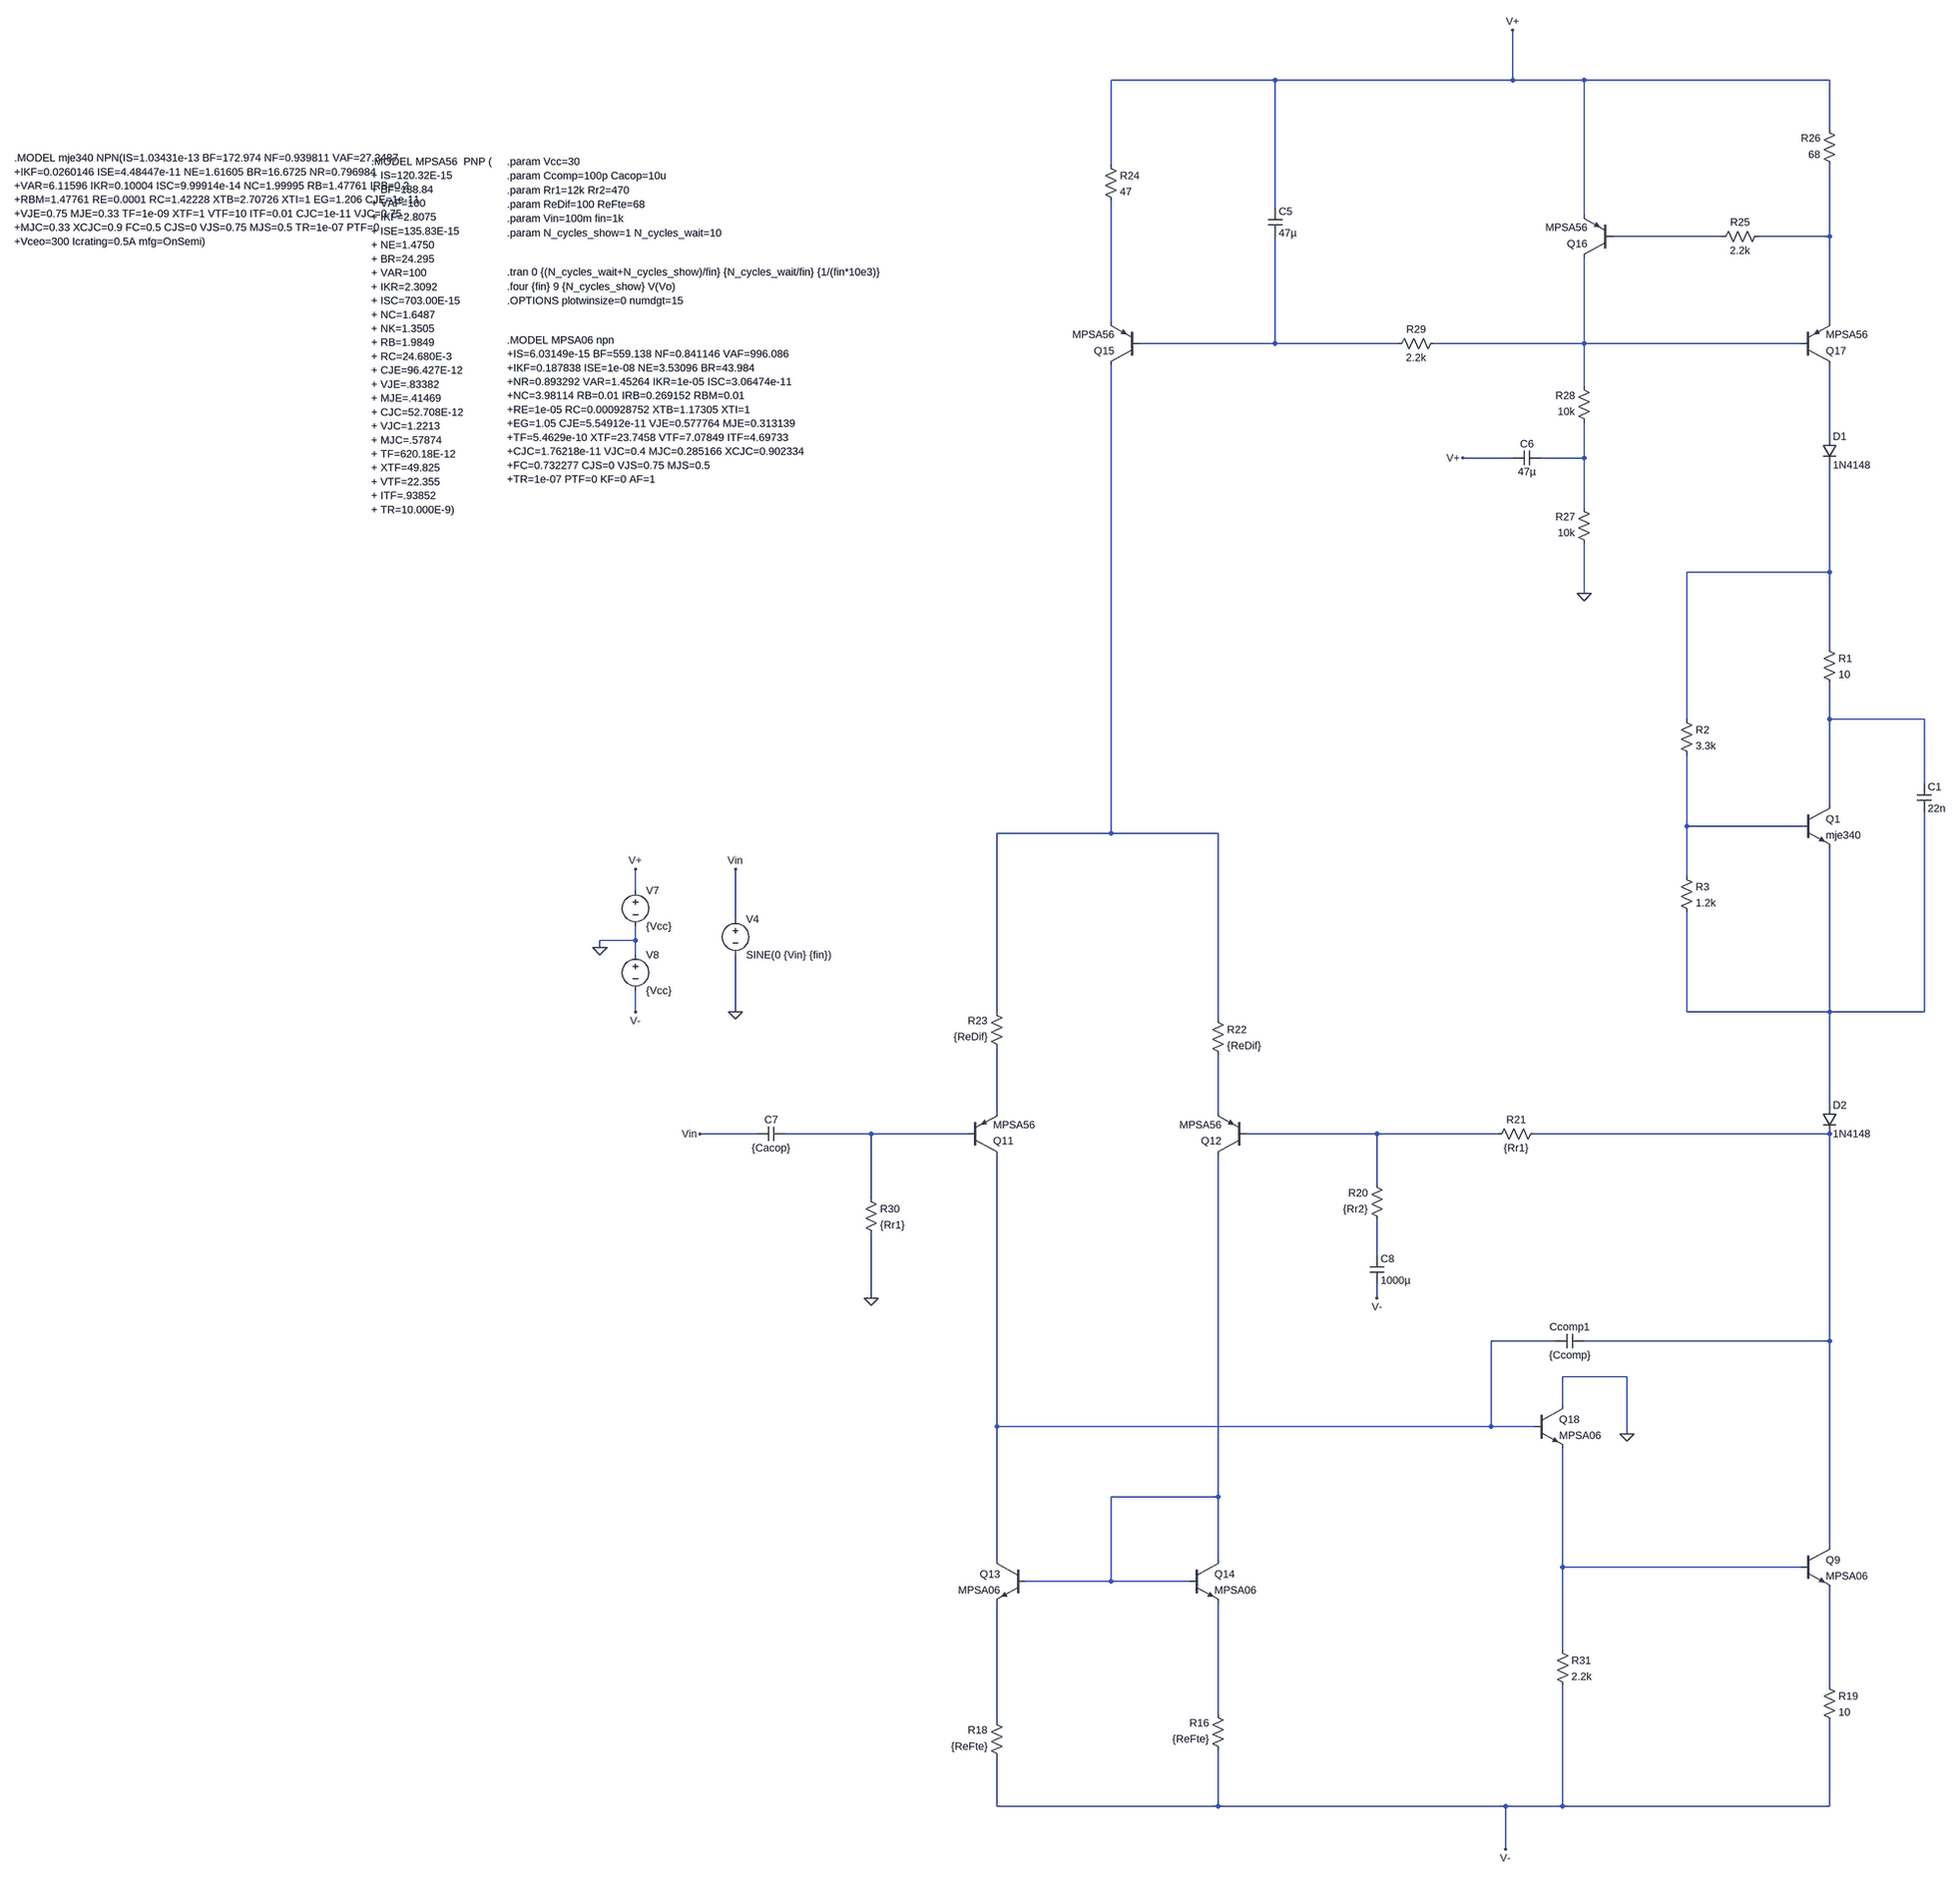
[diagram p0: schematic a.asc]
a.asc, the LTspice schematic file:
Version 4
SHEET 1 4644 2696
WIRE 1792 -1888 1424 -1888
WIRE 2384 -1888 2384 -2032
WIRE 2384 -1888 1792 -1888
WIRE 2544 -1888 2384 -1888
WIRE 3104 -1888 2544 -1888
WIRE 3104 -1776 3104 -1888
WIRE 1424 -1696 1424 -1888
WIRE 1792 -1600 1792 -1888
WIRE 2544 -1584 2544 -1888
WIRE 2864 -1536 2608 -1536
WIRE 3104 -1536 3104 -1696
WIRE 3104 -1536 2944 -1536
WIRE 1424 -1344 1424 -1616
WIRE 3104 -1344 3104 -1536
WIRE 1792 -1296 1792 -1536
WIRE 1792 -1296 1488 -1296
WIRE 2128 -1296 1792 -1296
WIRE 2544 -1296 2544 -1488
WIRE 2544 -1296 2208 -1296
WIRE 3040 -1296 2544 -1296
WIRE 2544 -1200 2544 -1296
WIRE 3104 -1088 3104 -1248
WIRE 2384 -1040 2272 -1040
WIRE 2544 -1040 2544 -1120
WIRE 2544 -1040 2448 -1040
WIRE 2544 -928 2544 -1040
WIRE 3104 -784 3104 -1024
WIRE 3104 -784 2784 -784
WIRE 2544 -736 2544 -848
WIRE 3104 -608 3104 -784
WIRE 2784 -448 2784 -784
WIRE 3104 -448 3104 -528
WIRE 3328 -448 3104 -448
WIRE 3328 -304 3328 -448
WIRE 3104 -256 3104 -448
WIRE 2784 -208 2784 -368
WIRE 3040 -208 2784 -208
WIRE 1424 -192 1424 -1248
WIRE 1424 -192 1168 -192
WIRE 1664 -192 1424 -192
WIRE 2784 -96 2784 -208
WIRE 352 -64 352 -112
WIRE 576 0 576 -112
WIRE 352 48 352 16
WIRE 352 48 272 48
WIRE 272 64 272 48
WIRE 352 80 352 48
WIRE 352 208 352 160
WIRE 576 208 576 80
WIRE 1168 208 1168 -192
WIRE 2784 208 2784 -16
WIRE 3104 208 3104 -160
WIRE 3104 208 2784 208
WIRE 3328 208 3328 -240
WIRE 3328 208 3104 208
WIRE 1664 224 1664 -192
WIRE 3104 704 3104 208
WIRE 1168 720 1168 288
WIRE 1664 720 1664 304
WIRE 624 768 496 768
WIRE 880 768 688 768
WIRE 1104 768 880 768
WIRE 2080 768 1728 768
WIRE 2352 768 2080 768
WIRE 3104 768 2432 768
WIRE 2080 880 2080 768
WIRE 880 912 880 768
WIRE 2080 1040 2080 960
WIRE 880 1136 880 992
WIRE 2080 1136 2080 1104
WIRE 2480 1232 2336 1232
WIRE 3104 1232 3104 768
WIRE 3104 1232 2544 1232
WIRE 2640 1312 2496 1312
WIRE 2496 1376 2496 1312
WIRE 1168 1424 1168 816
WIRE 2336 1424 2336 1232
WIRE 2336 1424 1168 1424
WIRE 2432 1424 2336 1424
WIRE 2640 1440 2640 1312
WIRE 1664 1696 1664 816
WIRE 1664 1696 1424 1696
WIRE 3104 1824 3104 1232
WIRE 1168 1856 1168 1424
WIRE 1664 1856 1664 1696
WIRE 2496 1872 2496 1472
WIRE 3040 1872 2496 1872
WIRE 1424 1904 1424 1696
WIRE 1424 1904 1232 1904
WIRE 1600 1904 1424 1904
WIRE 2496 2064 2496 1872
WIRE 3104 2144 3104 1920
WIRE 1664 2208 1664 1952
WIRE 1168 2224 1168 1952
WIRE 1168 2528 1168 2304
WIRE 1664 2528 1664 2288
WIRE 1664 2528 1168 2528
WIRE 2368 2528 1664 2528
WIRE 2496 2528 2496 2144
WIRE 2496 2528 2368 2528
WIRE 3104 2528 3104 2224
WIRE 3104 2528 2496 2528
WIRE 2368 2624 2368 2528
FLAG 576 208 0
FLAG 576 -112 Vin
FLAG 2544 -736 0
FLAG 2272 -1040 V+
FLAG 2080 1136 V-
FLAG 880 1136 0
FLAG 496 768 Vin
FLAG 2640 1440 0
FLAG 272 64 0
FLAG 352 -112 V+
FLAG 352 208 V-
FLAG 2384 -2032 V+
FLAG 2368 2624 V-
DATAFLAG 2080 768 ""
DATAFLAG 1424 -192 ""
DATAFLAG 880 768 ""
DATAFLAG 1424 -896 "-Ic(Q15)"
DATAFLAG 1168 32 "-I(R23)"
DATAFLAG 1664 32 "I(R22)"
DATAFLAG 1168 2096 ""
DATAFLAG 1664 2096 ""
DATAFLAG 1168 1424 ""
DATAFLAG 1664 1696 ""
DATAFLAG 2496 1872 ""
DATAFLAG 2496 1632 "Ic(Q18)"
DATAFLAG 3104 2048 ""
DATAFLAG 3104 2352 "I(R19)"
DATAFLAG 1424 -1488 ""
DATAFLAG 3104 -1552 ""
DATAFLAG 2544 -1296 ""
DATAFLAG 1776 -1296 ""
DATAFLAG 1168 960 "-Ic(Q11)"
DATAFLAG 1664 960 "-Ic(Q12)"
DATAFLAG 3104 1472 "Ic(Q9)"
DATAFLAG 3104 448 ""
DATAFLAG 3104 -784 ""
DATAFLAG 3104 -448 ""
DATAFLAG 1312 -1632 "V(v+)-V(n003)"
DATAFLAG 3216 -1728 "V(v+)-v(n002)"
DATAFLAG 976 256 "V(n011)-v(n013)"
DATAFLAG 1824 240 "V(n011)-v(n014)"
DATAFLAG 976 2272 "V(n024)-v(v-)"
DATAFLAG 1776 2256 "V(n023)-v(v-)"
DATAFLAG 2352 2112 "V(n021)-v(v-)"
DATAFLAG 3264 2192 "V(n022)-v(v-)"
DATAFLAG 3104 1232 ""
SYMBOL res 1680 2304 R180
WINDOW 0 36 76 Left 2
WINDOW 3 36 40 Left 2
SYMATTR InstName R16
SYMATTR Value {ReFte}
SYMBOL res 1184 2320 R180
WINDOW 0 36 76 Left 2
WINDOW 3 36 40 Left 2
SYMATTR InstName R18
SYMATTR Value {ReFte}
SYMBOL npn 3040 1824 R0
SYMATTR InstName Q9
SYMATTR Value MPSA06
SYMBOL voltage 576 -16 R0
WINDOW 123 0 0 Left 2
WINDOW 39 0 0 Left 2
SYMATTR InstName V4
SYMATTR Value SINE(0 {Vin} {fin})
SYMBOL res 3088 2128 R0
SYMATTR InstName R19
SYMATTR Value 10
SYMBOL res 2096 976 R180
WINDOW 0 36 76 Left 2
WINDOW 3 36 40 Left 2
SYMATTR InstName R20
SYMATTR Value {Rr2}
SYMBOL pnp 1104 816 M180
SYMATTR InstName Q11
SYMATTR Value MPSA56
SYMBOL pnp 1728 816 R180
SYMATTR InstName Q12
SYMATTR Value MPSA56
SYMBOL npn 1232 1856 M0
SYMATTR InstName Q13
SYMATTR Value MPSA06
SYMBOL npn 1600 1856 R0
SYMATTR InstName Q14
SYMATTR Value MPSA06
SYMBOL res 2448 752 R90
WINDOW 0 0 56 VBottom 2
WINDOW 3 32 56 VTop 2
SYMATTR InstName R21
SYMATTR Value {Rr1}
SYMBOL res 1648 208 R0
SYMATTR InstName R22
SYMATTR Value {ReDif}
SYMBOL res 1184 304 R180
WINDOW 0 36 76 Left 2
WINDOW 3 36 40 Left 2
SYMATTR InstName R23
SYMATTR Value {ReDif}
SYMBOL pnp 1488 -1248 R180
SYMATTR InstName Q15
SYMATTR Value MPSA56
SYMBOL pnp 2608 -1488 R180
SYMATTR InstName Q16
SYMATTR Value MPSA56
SYMBOL pnp 3040 -1248 M180
SYMATTR InstName Q17
SYMATTR Value MPSA56
SYMBOL cap 1776 -1600 R0
SYMATTR InstName C5
SYMATTR Value 47µ
SYMBOL cap 2384 -1024 R270
WINDOW 0 32 32 VTop 2
WINDOW 3 0 32 VBottom 2
SYMATTR InstName C6
SYMATTR Value 47µ
SYMBOL res 1408 -1712 R0
SYMATTR InstName R24
SYMATTR Value 47
SYMBOL res 2960 -1552 R90
WINDOW 0 0 56 VBottom 2
WINDOW 3 32 56 VTop 2
SYMATTR InstName R25
SYMATTR Value 2.2k
SYMBOL res 3120 -1680 R180
WINDOW 0 36 76 Left 2
WINDOW 3 36 40 Left 2
SYMATTR InstName R26
SYMATTR Value 68
SYMBOL res 2560 -832 R180
WINDOW 0 36 76 Left 2
WINDOW 3 36 40 Left 2
SYMATTR InstName R27
SYMATTR Value 10k
SYMBOL res 2560 -1104 R180
WINDOW 0 36 76 Left 2
WINDOW 3 36 40 Left 2
SYMATTR InstName R28
SYMATTR Value 10k
SYMBOL res 2112 -1280 R270
WINDOW 0 32 56 VTop 2
WINDOW 3 0 56 VBottom 2
SYMATTR InstName R29
SYMATTR Value 2.2k
SYMBOL res 864 896 R0
SYMATTR InstName R30
SYMATTR Value {Rr1}
SYMBOL cap 688 752 R90
WINDOW 0 0 32 VBottom 2
WINDOW 3 32 32 VTop 2
SYMATTR InstName C7
SYMATTR Value {Cacop}
SYMBOL cap 2064 1040 R0
SYMATTR InstName C8
SYMATTR Value 1000µ
SYMBOL npn 2432 1376 R0
SYMATTR InstName Q18
SYMATTR Value MPSA06
SYMBOL res 2480 2048 R0
SYMATTR InstName R31
SYMATTR Value 2.2k
SYMBOL cap 2544 1216 R90
WINDOW 0 0 32 VBottom 2
WINDOW 3 32 32 VTop 2
SYMATTR InstName Ccomp1
SYMATTR Value {Ccomp}
SYMBOL voltage 352 -80 R0
WINDOW 123 0 0 Left 2
WINDOW 39 0 0 Left 2
SYMATTR InstName V7
SYMATTR Value {Vcc}
SYMBOL voltage 352 64 R0
WINDOW 123 0 0 Left 2
WINDOW 39 0 0 Left 2
SYMATTR InstName V8
SYMATTR Value {Vcc}
SYMBOL npn 3040 -256 R0
SYMATTR InstName Q1
SYMATTR Value mje340
SYMBOL res 3088 -624 R0
SYMATTR InstName R1
SYMATTR Value 10
SYMBOL res 2768 -464 R0
SYMATTR InstName R2
SYMATTR Value 3.3k
SYMBOL res 2768 -112 R0
SYMATTR InstName R3
SYMATTR Value 1.2k
SYMBOL cap 3312 -304 R0
SYMATTR InstName C1
SYMATTR Value 22n
SYMBOL diode 3088 -1088 R0
SYMATTR InstName D1
SYMATTR Value 1N4148
SYMBOL diode 3088 704 R0
SYMATTR InstName D2
SYMATTR Value 1N4148
TEXT 64 -1456 Left 2 !.tran 0 {(N_cycles_wait+N_cycles_show)/fin} {N_cycles_wait/fin} {1/(fin*10e3)}
TEXT 64 -1424 Left 2 !.four {fin} 9 {N_cycles_show} V(Vo)
TEXT 64 -1392 Left 2 !.OPTIONS plotwinsize=0 numdgt=15
TEXT 64 -1544 Left 2 !.param N_cycles_show=1 N_cycles_wait=10
TEXT 64 -1576 Left 2 !.param Vin=100m fin=1k
TEXT 64 -1608 Left 2 !.param ReDif=100 ReFte=68
TEXT 64 -1640 Left 2 !.param Rr1=12k Rr2=470
TEXT 64 -1672 Left 2 !.param Ccomp=100p Cacop=10u
TEXT 64 -1704 Left 2 !.param Vcc=30
TEXT -240 -1704 Left 2 !.MODEL MPSA56  PNP (\n+ IS=120.32E-15\n+ BF=188.84\n+ VAF=100\n+ IKF=2.8075\n+ ISE=135.83E-15\n+ NE=1.4750\n+ BR=24.295\n+ VAR=100\n+ IKR=2.3092\n+ ISC=703.00E-15\n+ NC=1.6487\n+ NK=1.3505\n+ RB=1.9849\n+ RC=24.680E-3\n+ CJE=96.427E-12\n+ VJE=.83382\n+ MJE=.41469\n+ CJC=52.708E-12\n+ VJC=1.2213\n+ MJC=.57874\n+ TF=620.18E-12\n+ XTF=49.825\n+ VTF=22.355\n+ ITF=.93852\n+ TR=10.000E-9)
TEXT 64 -1304 Left 2 !.MODEL MPSA06 npn\n+IS=6.03149e-15 BF=559.138 NF=0.841146 VAF=996.086\n+IKF=0.187838 ISE=1e-08 NE=3.53096 BR=43.984\n+NR=0.893292 VAR=1.45264 IKR=1e-05 ISC=3.06474e-11\n+NC=3.98114 RB=0.01 IRB=0.269152 RBM=0.01\n+RE=1e-05 RC=0.000928752 XTB=1.17305 XTI=1\n+EG=1.05 CJE=5.54912e-11 VJE=0.577764 MJE=0.313139\n+TF=5.4629e-10 XTF=23.7458 VTF=7.07849 ITF=4.69733\n+CJC=1.76218e-11 VJC=0.4 MJC=0.285166 XCJC=0.902334\n+FC=0.732277 CJS=0 VJS=0.75 MJS=0.5\n+TR=1e-07 PTF=0 KF=0 AF=1
TEXT -1040 -1712 Left 2 !.MODEL mje340 NPN(IS=1.03431e-13 BF=172.974 NF=0.939811 VAF=27.3487\n+IKF=0.0260146 ISE=4.48447e-11 NE=1.61605 BR=16.6725 NR=0.796984\n+VAR=6.11596 IKR=0.10004 ISC=9.99914e-14 NC=1.99995 RB=1.47761 IRB=0.2\n+RBM=1.47761 RE=0.0001 RC=1.42228 XTB=2.70726 XTI=1 EG=1.206 CJE=1e-11\n+VJE=0.75 MJE=0.33 TF=1e-09 XTF=1 VTF=10 ITF=0.01 CJC=1e-11 VJC=0.75\n+MJC=0.33 XCJC=0.9 FC=0.5 CJS=0 VJS=0.75 MJS=0.5 TR=1e-07 PTF=0\n+Vceo=300 Icrating=0.5A mfg=OnSemi)

The netlist it stands for:
* a.asc
R16 V- N023 {ReFte}
R18 V- N024 {ReFte}
Q9 N017 N021 N022 0 MPSA06
V4 Vin 0 SINE(0 {Vin} {fin})
R19 N022 V- 10
R20 N018 N016 {Rr2}
Q11 N019 N015 N013 0 MPSA56
Q12 N020 N016 N014 0 MPSA56
Q13 N019 N020 N024 0 MPSA06
Q14 N020 N020 N023 0 MPSA06
R21 N017 N016 {Rr1}
R22 N011 N014 {ReDif}
R23 N013 N011 {ReDif}
Q15 N011 N004 N003 0 MPSA56
Q16 N005 N001 V+ 0 MPSA56
Q17 N006 N005 N002 0 MPSA56
C5 V+ N004 47µ
C6 V+ N007 47µ
R24 V+ N003 47
R25 N002 N001 2.2k
R26 N002 V+ 68
R27 0 N007 10k
R28 N007 N005 10k
R29 N004 N005 2.2k
R30 N015 0 {Rr1}
C7 N015 Vin {Cacop}
C8 N018 V- 1000µ
Q18 0 N019 N021 0 MPSA06
R31 N021 V- 2.2k
Ccomp1 N017 N019 {Ccomp}
V7 V+ 0 {Vcc}
V8 0 V- {Vcc}
Q1 N009 N010 N012 0 mje340
R1 N008 N009 10
R2 N008 N010 3.3k
R3 N010 N012 1.2k
C1 N009 N012 22n
D1 N006 N008 1N4148
D2 N012 N017 1N4148
.model D D
.lib standard.dio
.model NPN NPN
.model PNP PNP
.lib standard.bjt
.tran 0 {(N_cycles_wait+N_cycles_show)/fin} {N_cycles_wait/fin} {1/(fin*10e3)}
.four {fin} 9 {N_cycles_show} V(Vo)
.OPTIONS plotwinsize=0 numdgt=15
.param N_cycles_show=1 N_cycles_wait=10
.param Vin=100m fin=1k
.param ReDif=100 ReFte=68
.param Rr1=12k Rr2=470
.param Ccomp=100p Cacop=10u
.param Vcc=30
.MODEL MPSA56  PNP (
+ IS=120.32E-15
+ BF=188.84
+ VAF=100
+ IKF=2.8075
+ ISE=135.83E-15
+ NE=1.4750
+ BR=24.295
+ VAR=100
+ IKR=2.3092
+ ISC=703.00E-15
+ NC=1.6487
+ NK=1.3505
+ RB=1.9849
+ RC=24.680E-3
+ CJE=96.427E-12
+ VJE=.83382
+ MJE=.41469
+ CJC=52.708E-12
+ VJC=1.2213
+ MJC=.57874
+ TF=620.18E-12
+ XTF=49.825
+ VTF=22.355
+ ITF=.93852
+ TR=10.000E-9)
.MODEL MPSA06 npn
+IS=6.03149e-15 BF=559.138 NF=0.841146 VAF=996.086
+IKF=0.187838 ISE=1e-08 NE=3.53096 BR=43.984
+NR=0.893292 VAR=1.45264 IKR=1e-05 ISC=3.06474e-11
+NC=3.98114 RB=0.01 IRB=0.269152 RBM=0.01
+RE=1e-05 RC=0.000928752 XTB=1.17305 XTI=1
+EG=1.05 CJE=5.54912e-11 VJE=0.577764 MJE=0.313139
+TF=5.4629e-10 XTF=23.7458 VTF=7.07849 ITF=4.69733
+CJC=1.76218e-11 VJC=0.4 MJC=0.285166 XCJC=0.902334
+FC=0.732277 CJS=0 VJS=0.75 MJS=0.5
+TR=1e-07 PTF=0 KF=0 AF=1
.MODEL mje340 NPN(IS=1.03431e-13 BF=172.974 NF=0.939811 VAF=27.3487
+IKF=0.0260146 ISE=4.48447e-11 NE=1.61605 BR=16.6725 NR=0.796984
+VAR=6.11596 IKR=0.10004 ISC=9.99914e-14 NC=1.99995 RB=1.47761 IRB=0.2
+RBM=1.47761 RE=0.0001 RC=1.42228 XTB=2.70726 XTI=1 EG=1.206 CJE=1e-11
+VJE=0.75 MJE=0.33 TF=1e-09 XTF=1 VTF=10 ITF=0.01 CJC=1e-11 VJC=0.75
+MJC=0.33 XCJC=0.9 FC=0.5 CJS=0 VJS=0.75 MJS=0.5 TR=1e-07 PTF=0
+Vceo=300 Icrating=0.5A mfg=OnSemi)
.backanno
.end